# Altium schematic sheet NTC_Head_2.SchDoc: Sheetname
size A4; Date: 05.10.2017; CheckedBy: UNCHECKED; Author: Team Member; Organization: Baltic Racing; Address1: Zur Schwedenschanze 15; Address2: Haus 18; Address3: 18435 Stralsund; Revision: xx.xx; SheetNumber: 2; SheetTotal: 2; Rules: TODO; ProjectName: Projekt
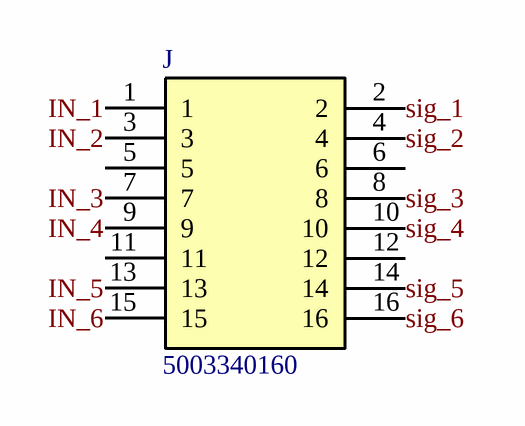
[diagram p0: NTC_Head_2.SchDoc]

## Parts
J  5003340160  [5003340160]

## Nets
IN_1: J.1
IN_2: J.3
IN_3: J.7
IN_4: J.9
IN_5: J.13
IN_6: J.15
sig_1: J.2
sig_2: J.4
sig_3: J.8
sig_4: J.10
sig_5: J.14
sig_6: J.16

Not connected (* = marked no-connect by the designer): J 5 6 11 12

## Notes on the sheet
- Title:
- Projekt:
- Revision:
- Author:
- Rules:
- Checked by:
- Sheet
- of
- Size:
- A4
- Date:
- Time:

## Library data of the parts
J = 5003340160: 0.50mm Pitch SlimStack Plug, Surface Mount, Dual Row, Vertical, 2.50mm Stack Height, 16 Circuits